# EAGLE schematic untitled (EAGLE 8.4.0)
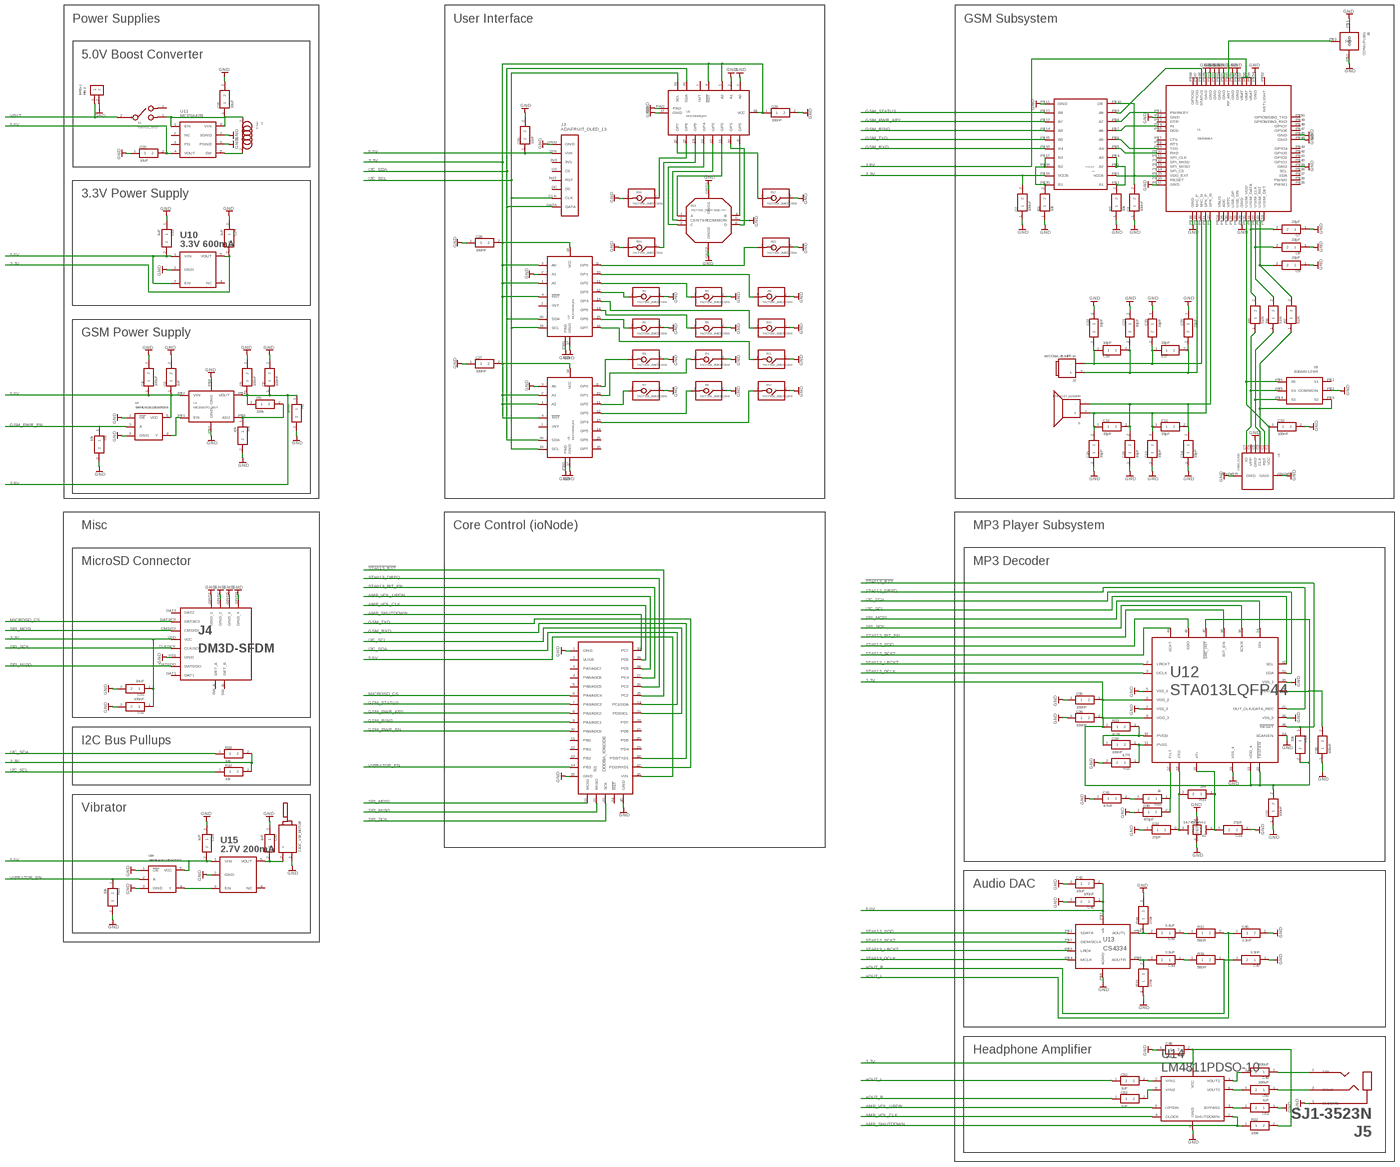
[diagram p0: schematic, sheet 1, overview]
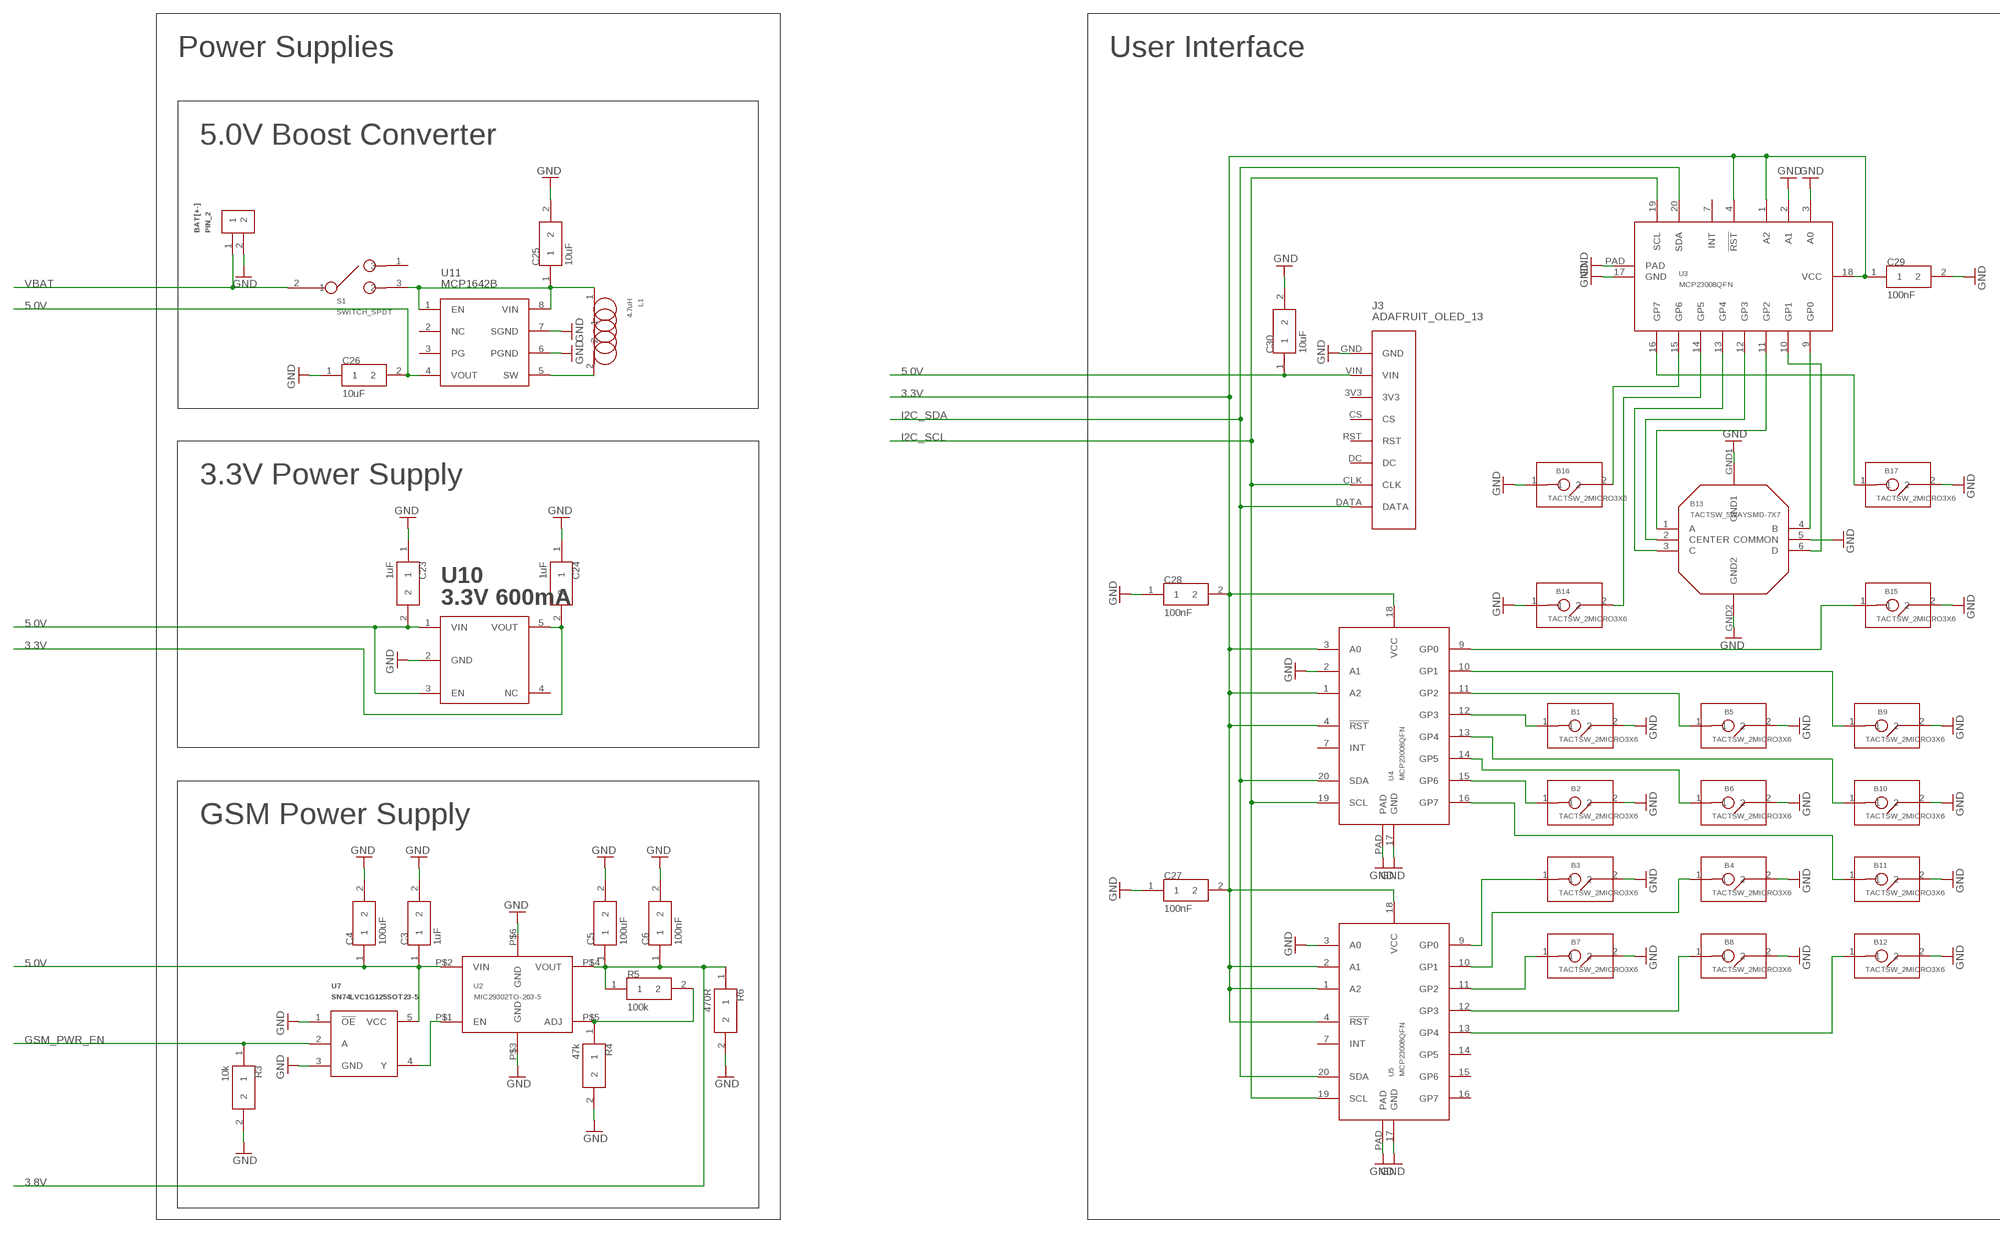
[diagram p1: schematic, sheet 1, part 1 of 4]
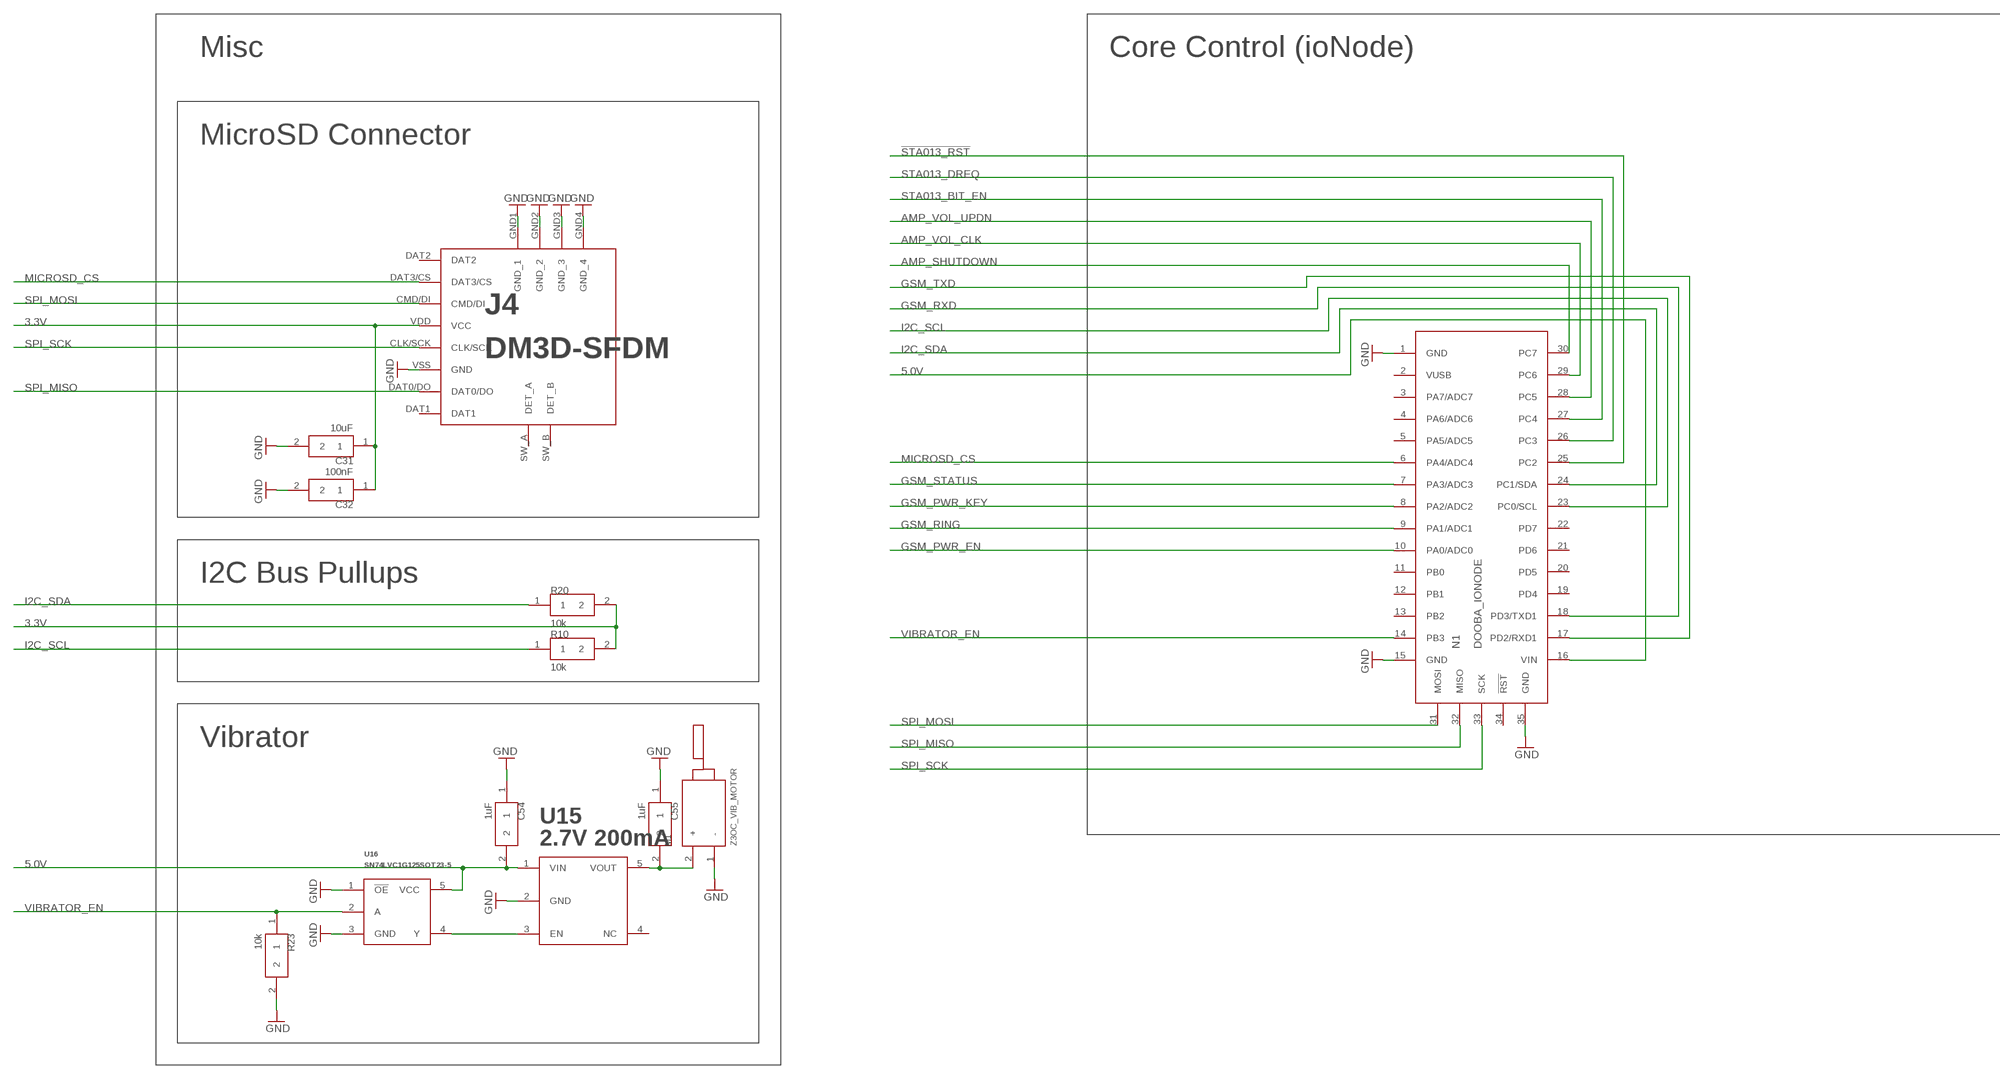
[diagram p2: schematic, sheet 1, part 2 of 4]
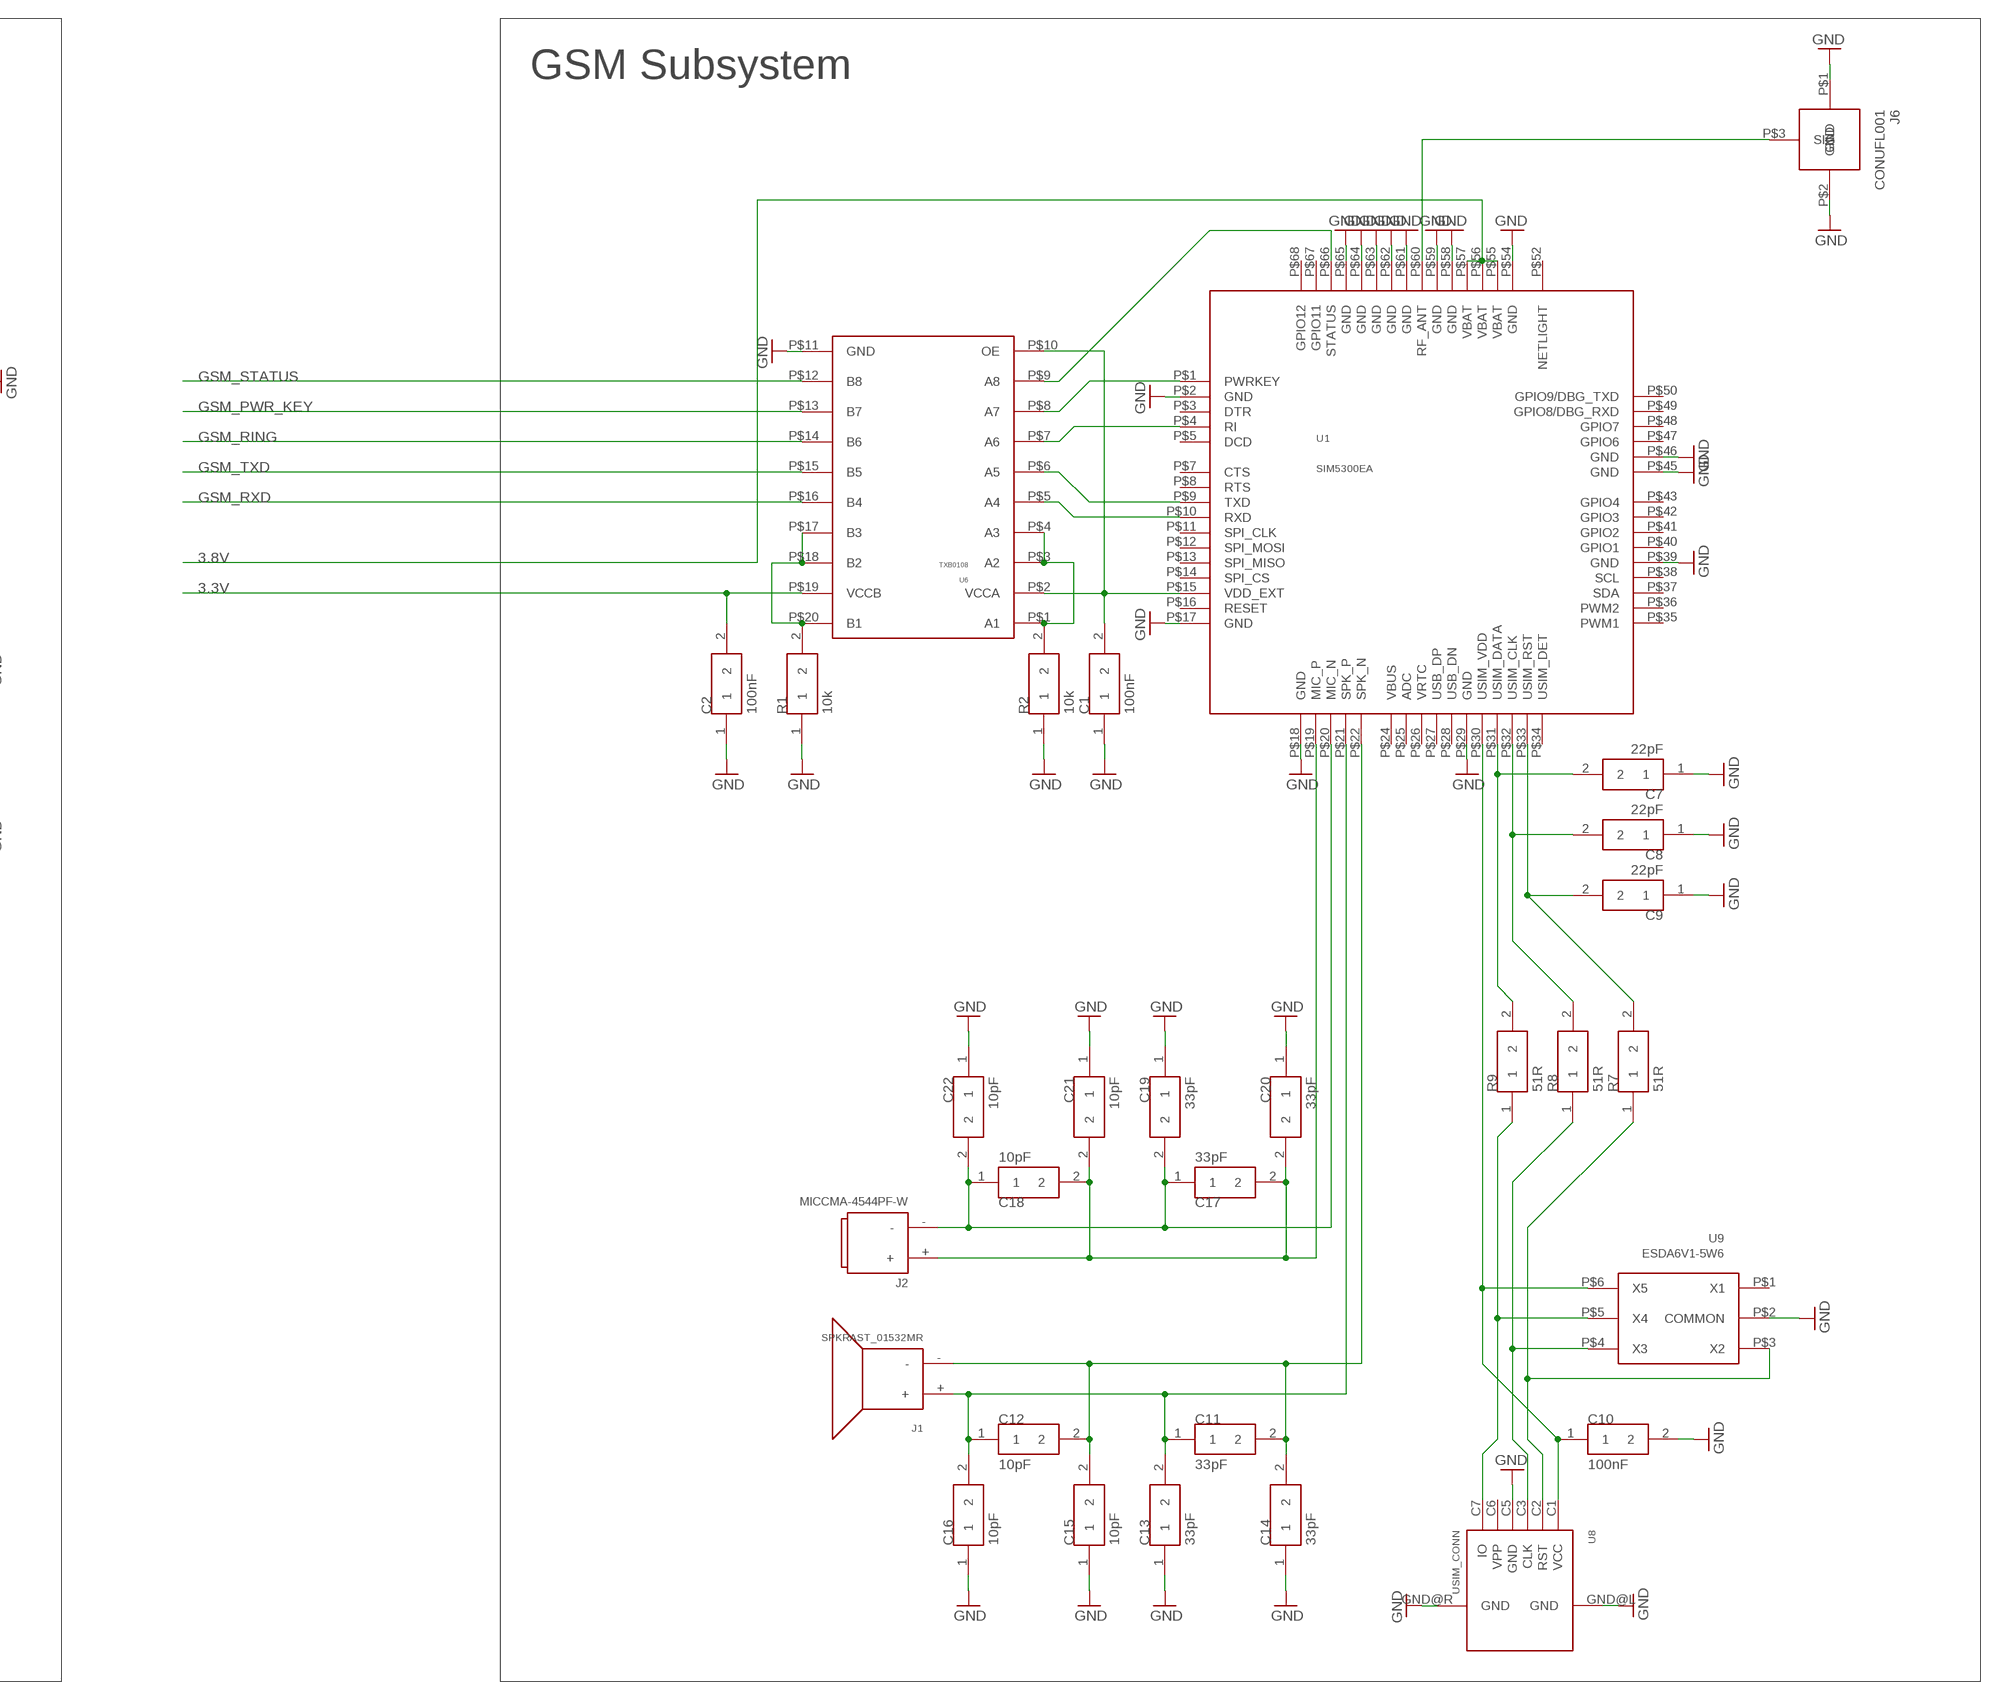
[diagram p3: schematic, sheet 1, part 3 of 4]
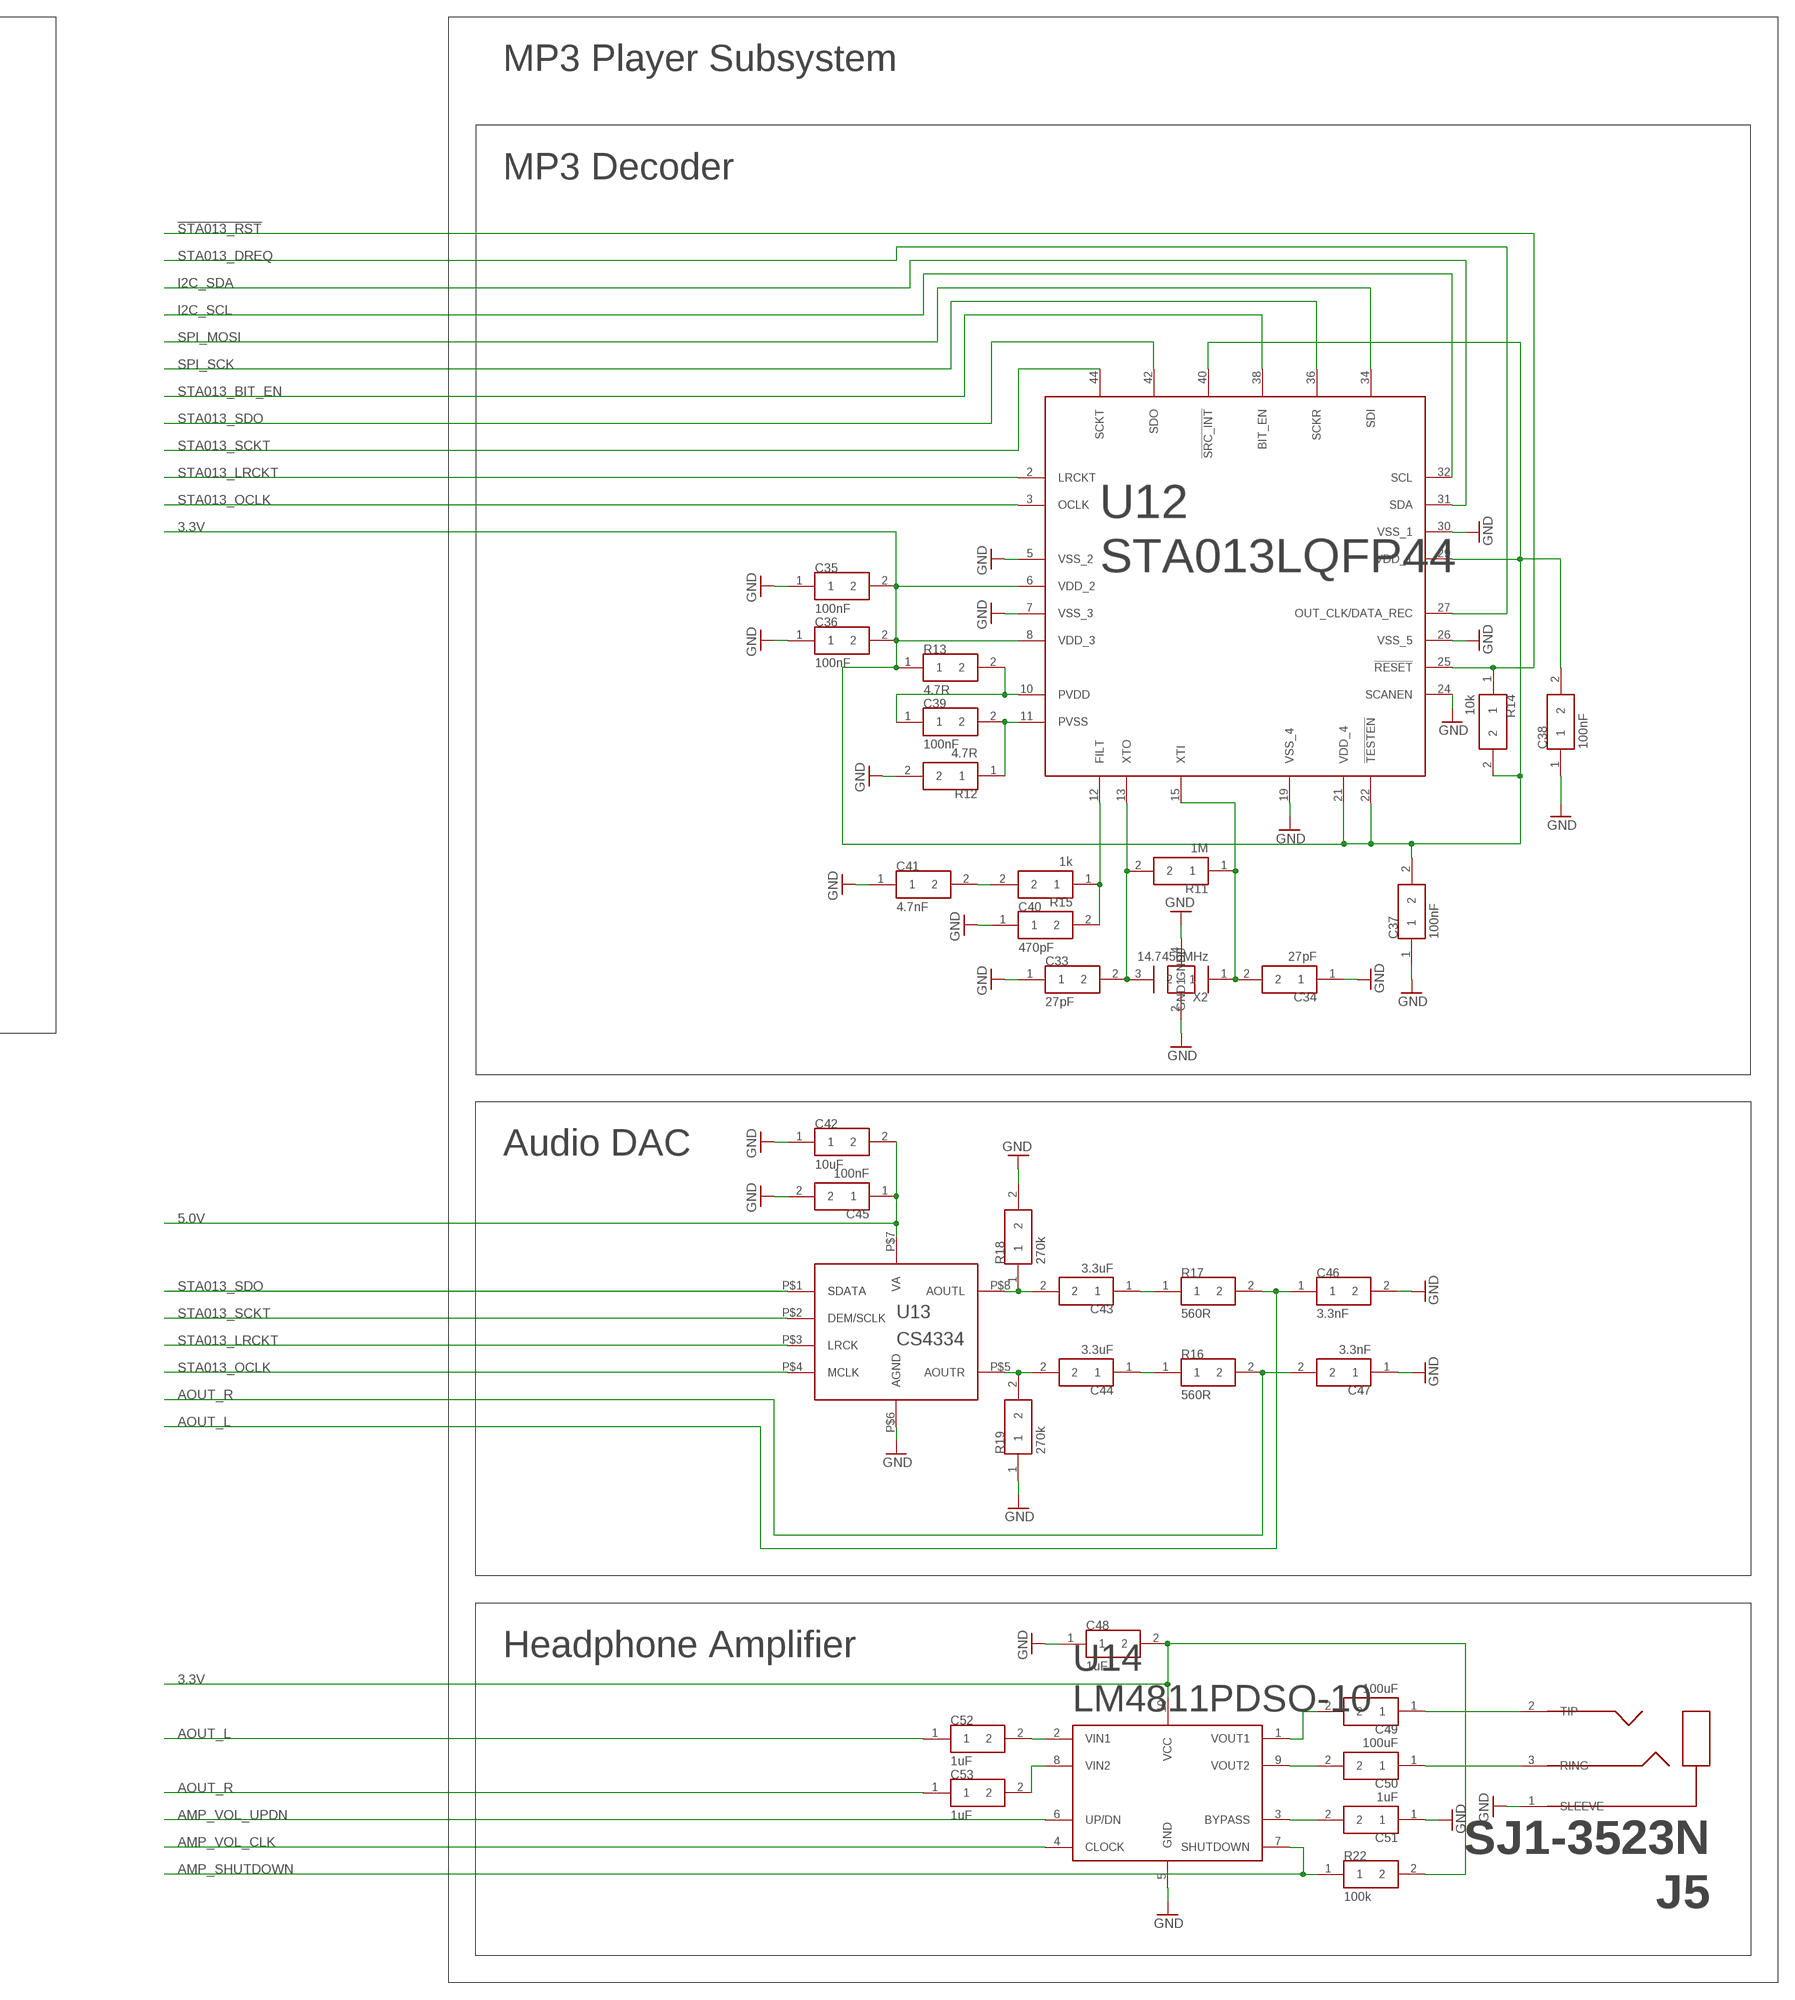
[diagram p4: schematic, sheet 1, part 4 of 4]

## Parts
B1  TACTSW_2MICRO3X6  [TACTSW_MICRO3X6]
B2  TACTSW_2MICRO3X6  [TACTSW_MICRO3X6]
B3  TACTSW_2MICRO3X6  [TACTSW_MICRO3X6]
B4  TACTSW_2MICRO3X6  [TACTSW_MICRO3X6]
B5  TACTSW_2MICRO3X6  [TACTSW_MICRO3X6]
B6  TACTSW_2MICRO3X6  [TACTSW_MICRO3X6]
B7  TACTSW_2MICRO3X6  [TACTSW_MICRO3X6]
B8  TACTSW_2MICRO3X6  [TACTSW_MICRO3X6]
B9  TACTSW_2MICRO3X6  [TACTSW_MICRO3X6]
B10  TACTSW_2MICRO3X6  [TACTSW_MICRO3X6]
B11  TACTSW_2MICRO3X6  [TACTSW_MICRO3X6]
B12  TACTSW_2MICRO3X6  [TACTSW_MICRO3X6]
B13  TACTSW_5WAYSMD-7X7  [TACTSW-5WAY-7X7]
B14  TACTSW_2MICRO3X6  [TACTSW_MICRO3X6]
B15  TACTSW_2MICRO3X6  [TACTSW_MICRO3X6]
B16  TACTSW_2MICRO3X6  [TACTSW_MICRO3X6]
B17  TACTSW_2MICRO3X6  [TACTSW_MICRO3X6]
BAT[+-]  PIN_2  [PIN_2]
C1  100nF  CAP0805  [0805]
C2  100nF  CAP0805  [0805]
C3  1uF  CAP0805  [0805]
C4  100uF  CAP1210  [1210]
C5  100uF  CAP1210  [1210]
C6  100nF  CAP0805  [0805]
C7  22pF  CAP0805  [0805]
C8  22pF  CAP0805  [0805]
C9  22pF  CAP0805  [0805]
C10  100nF  CAP0805  [0805]
C11  33pF  CAP0805  [0805]
C12  10pF  CAP0805  [0805]
C13  33pF  CAP0805  [0805]
C14  33pF  CAP0805  [0805]
C15  10pF  CAP0805  [0805]
C16  10pF  CAP0805  [0805]
C17  33pF  CAP0805  [0805]
C18  10pF  CAP0805  [0805]
C19  33pF  CAP0805  [0805]
C20  33pF  CAP0805  [0805]
C21  10pF  CAP0805  [0805]
C22  10pF  CAP0805  [0805]
C23  1uF  CAP0805  [0805]
C24  1uF  CAP0805  [0805]
C25  10uF  CAP0805  [0805]
C26  10uF  CAP0805  [0805]
C27  100nF  CAP0805  [0805]
C28  100nF  CAP0805  [0805]
C29  100nF  CAP0805  [0805]
C30  10uF  CAP0805  [0805]
C31  10uF  CAP0805  [0805]
C32  100nF  CAP0805  [0805]
C33  27pF  CAP0805  [0805]
C34  27pF  CAP0805  [0805]
C35  100nF  CAP0805  [0805]
C36  100nF  CAP0805  [0805]
C37  100nF  CAP0805  [0805]
C38  100nF  CAP0805  [0805]
C39  100nF  CAP0805  [0805]
C40  470pF  CAP0805  [0805]
C41  4.7nF  CAP0805  [0805]
C42  10uF  CAP0805  [0805]
C43  3.3uF  CAP0805  [0805]
C44  3.3uF  CAP0805  [0805]
C45  100nF  CAP0805  [0805]
C46  3.3nF  CAP0805  [0805]
C47  3.3nF  CAP0805  [0805]
C48  1uF  CAP0805  [0805]
C49  100uF  CAP1210  [1210]
C50  100uF  CAP1210  [1210]
C51  1uF  CAP0805  [0805]
C52  1uF  CAP0805  [0805]
C53  1uF  CAP0805  [0805]
C54  1uF  CAP0805  [0805]
C55  1uF  CAP0805  [0805]
J1  SPKRAST_01532MR  [SPKR_AST_01532MR]
J2  MICCMA-4544PF-W  [MIC_CMA-4544PF-W]
J3  ADAFRUIT_OLED_13  [ADAFRUIT_OLED_13]
J4  DM3D-SFDM  [DM3D-SF]
J5  SJ1-3523N  [SJ1-352XN]
J6  CONUFL001  [CONUFL001]
L1  4.7uH  IND2520  [2520]
M1  Z3OC_VIB_MOTOR  [Z3OC_VIB_MOTOR]
N1  DOOBA_IONODE  [DOOBA_IONODE]
R1  10k  RES0805  [0805]
R2  10k  RES0805  [0805]
R3  10k  RES0805  [0805]
R4  47k  RES0805  [0805]
R5  100k  RES0805  [0805]
R6  470R  RES0805  [0805]
R7  51R  RES0805  [0805]
R8  51R  RES0805  [0805]
R9  51R  RES0805  [0805]
R10  10k  RES0805  [0805]
R11  1M  RES0805  [0805]
R12  4.7R  RES0805  [0805]
R13  4.7R  RES0805  [0805]
R14  10k  RES0805  [0805]
R15  1k  RES0805  [0805]
R16  560R  RES0805  [0805]
R17  560R  RES0805  [0805]
R18  270k  RES0805  [0805]
R19  270k  RES0805  [0805]
R20  10k  RES0805  [0805]
R22  100k  RES0805  [0805]
R23  10k  RES0805  [0805]
S1  SWITCH_SPDT  [JS102011]
U1  SIM5300EA  [SIM5300]
U2  MIC29302TO-263-5  [TO-263]
U3  MCP23008QFN  [20-VQFN]
U4  MCP23008QFN  [20-VQFN]
U5  MCP23008QFN  [20-VQFN]
U6  TXB0108  [TSSOP-20]
U7  SN74LVC1G125SOT23-5  [SOT23-5]
U8  USIM_CONN  [WE_USIM_HINGE]
U9  ESDA6V1-5W6  [SOT-323-6L]
U10  3.3V 600mA  LP3985SOT23-5  [SOT23-5]
U11  MCP1642B  [MSOP8]
U12  STA013LQFP44  [QFP44]
U13  CS4334  [SO8]
U14  LM4811PDSO-10  [PDSO-10]
U15  2.7V 200mA  LP3985SOT23-5  [SOT23-5]
U16  SN74LVC1G125SOT23-5  [SOT23-5]
X2  14.7456MHz  XTAL_GNDSMD_3225  [XTAL_3225]

## Nets
2.7V: C55.2 M1.2(+) U15.5(VOUT)
3.3V: C2.2 C24.2 C27.2 C28.2 C29.1 C31.1 C32.1 C35.2 C36.2 C37.2 C38.2 C48.2 J4.VDD(VCC) R10.2 R13.1 R14.2 R20.2 R22.2 U3.1(A2) U3.4(!RST) U3.18(VCC) U4.1(A2) U4.3(A0) U4.4(!RST) U4.18(VCC) U5.1(A2) U5.2(A1) U5.4(!RST) U5.18(VCC) U6.P$19(VCCB) U10.5(VOUT) U12.6(VDD_2) U12.8(VDD_3) U12.21(VDD_4) U12.22(!TESTEN) U12.29(VDD_1) U12.40(!SRC_INT) U14.10(VCC)
3.8V: C5.1 C6.1 R5.1 R6.1 U1.P$55(VBAT) U1.P$56(VBAT) U1.P$57(VBAT) U2.P$4(VOUT)
5.0V: C3.1 C4.1 C23.2 C26.2 C30.1 C42.2 C45.1 C54.2 J3.VIN N1.16(VIN) U2.P$2(VIN) U7.5(VCC) U10.1(VIN) U10.3(EN) U11.4(VOUT) U13.P$7(VA) U15.1(VIN) U16.5(VCC)
!STA013_RST: N1.25(PC2) R14.1 U12.25(!RESET)
AMP_SHUTDOWN: N1.30(PC7) R22.1 U14.7(SHUTDOWN)
AMP_VOL_CLK: N1.29(PC6) U14.4(CLOCK)
AMP_VOL_UPDN: N1.28(PC5) U14.6(UP/DN)
AOUT_L: C46.1 C52.1 R17.2
AOUT_R: C47.2 C53.1 R16.2
GND: B1.2 B2.2 B3.2 B4.2 B5.2 B6.2 B7.2 B8.2 B9.2 B10.2 B11.2 B12.2 B13.5(COMMON) B13.GND1 B13.GND2 B14.1 B15.2 B16.1 B17.2 BAT[+-].2 C1.1 C2.1 C3.2 C4.2 C5.2 C6.2 C7.1 C8.1 C9.1 C10.2 C13.1 C14.1 C15.1 C16.1 C19.1 C20.1 C21.1 C22.1 C23.1 C24.1 C25.2 C26.1 C27.1 C28.1 C29.2 C30.2 C31.2 C32.2 C33.1 C34.1 C35.1 C36.1 C37.1 C38.1 C40.1 C41.1 C42.1 C45.2 C46.2 C47.1 C48.1 C51.1 C54.1 C55.1 J3.GND J4.GND1(GND_1) J4.GND2(GND_2) J4.GND3(GND_3) J4.GND4(GND_4) J4.VSS(GND) J5.1(SLEEVE) J6.P$1(GND) J6.P$2(GND) M1.1(-) N1.1(GND) N1.15(GND) N1.35(GND) R1.1 R2.1 R3.2 R4.2 R6.2 R12.2 R18.2 R19.1 R23.2 U1.P$2(GND) U1.P$17(GND) U1.P$18(GND) U1.P$29(GND) U1.P$39(GND) U1.P$45(GND) U1.P$46(GND) U1.P$54(GND) U1.P$58(GND) U1.P$59(GND) U1.P$61(GND) U1.P$62(GND) U1.P$63(GND) U1.P$64(GND) U1.P$65(GND) U2.P$3(GND) U2.P$6(GND) U3.2(A1) U3.3(A0) U3.17(GND) U3.PAD U4.2(A1) U4.17(GND) U4.PAD U5.3(A0) U5.17(GND) U5.PAD U6.P$11(GND) U7.1(!OE) U7.3(GND) U8.C5(GND) U8.GND@L(GND) U8.GND@R(GND) U9.P$2(COMMON) U10.2(GND) U11.6(PGND) U11.7(SGND) U12.5(VSS_2) U12.7(VSS_3) U12.19(VSS_4) U12.24(SCANEN) U12.26(VSS_5) U12.30(VSS_1) U13.P$6(AGND) U14.5(GND) U15.2(GND) U16.1(!OE) U16.3(GND) X2.2(GND0) X2.4(GND1)
GSM_PWR_EN: N1.10(PA0/ADC0) R3.1 U7.2(A)
GSM_PWR_KEY: N1.8(PA2/ADC2) U6.P$13(B7)
GSM_RING: N1.9(PA1/ADC1) U6.P$14(B6)
GSM_RXD: N1.18(PD3/TXD1) U6.P$16(B4)
GSM_STATUS: N1.7(PA3/ADC3) U6.P$12(B8)
GSM_TXD: N1.17(PD2/RXD1) U6.P$15(B5)
I2C_SCL: J3.CLK N1.23(PC0/SCL) R10.1 U3.19(SCL) U4.19(SCL) U5.19(SCL) U12.32(SCL)
I2C_SDA: J3.DATA N1.24(PC1/SDA) R20.1 U3.20(SDA) U4.20(SDA) U5.20(SDA) U12.31(SDA)
MICROSD_CS: J4.DAT3/CS N1.6(PA4/ADC4)
N$1: B13.4(B) U3.9(GP0)
N$2: B13.1(A) U3.11(GP2)
N$3: B13.2(CENTER) U3.12(GP3)
N$4: B13.3(C) U3.13(GP4)
N$5: B13.6(D) U3.10(GP1)
N$6: B14.2 U3.14(GP5)
N$7: B16.2 U3.15(GP6)
N$8: B17.1 U3.16(GP7)
N$9: B15.1 U4.9(GP0)
N$10: B9.1 U4.10(GP1)
N$11: B5.1 U4.11(GP2)
N$12: B1.1 U4.12(GP3)
N$13: B10.1 U4.13(GP4)
N$14: B6.1 U4.14(GP5)
N$15: B2.1 U4.15(GP6)
N$16: B11.1 U4.16(GP7)
N$17: B3.1 U5.9(GP0)
N$18: B4.1 U5.10(GP1)
N$19: B7.1 U5.11(GP2)
N$20: B8.1 U5.12(GP3)
N$21: B12.1 U5.13(GP4)
N$22: C1.2 U1.P$15(VDD_EXT) U6.P$2(VCCA) U6.P$10(OE)
N$23: U1.P$66(STATUS) U6.P$9(A8)
N$24: U1.P$1(PWRKEY) U6.P$8(A7)
N$25: U1.P$4(RI) U6.P$7(A6)
N$26: U1.P$9(TXD) U6.P$6(A5)
N$27: U1.P$10(RXD) U6.P$5(A4)
N$28: U2.P$1(EN) U7.4(Y)
N$29: R4.1 R5.2 U2.P$5(ADJ)
N$30: R1.2 U6.P$17(B3) U6.P$18(B2) U6.P$20(B1)
N$31: C10.1 U1.P$30(USIM_VDD) U8.C1(VCC) U9.P$6(X5)
N$32: R2.2 U6.P$1(A1) U6.P$3(A2) U6.P$4(A3)
N$33: R9.1 U8.C7(IO) U9.P$5(X4)
N$34: R8.1 U8.C3(CLK) U9.P$4(X3)
N$35: C34.2 R11.1 U12.15(XTI) X2.1
N$36: R7.1 U8.C2(RST) U9.P$3(X2)
N$37: C9.2 R7.2 U1.P$33(USIM_RST)
N$38: C8.2 R8.2 U1.P$32(USIM_CLK)
N$39: C7.2 R9.2 U1.P$31(USIM_DATA)
N$40: C33.2 R11.2 U12.13(XTO) X2.3
N$41: L1.2 U11.5(SW)
N$42: C39.1 R13.2 U12.10(PVDD)
N$43: C11.2 C12.2 C14.2 C15.2 J1.- U1.P$22(SPK_N)
N$44: C11.1 C12.1 C13.2 C16.2 J1.+ U1.P$21(SPK_P)
N$45: C39.2 R12.1 U12.11(PVSS)
N$46: C41.2 R15.2
N$47: C17.2 C18.2 C20.2 C21.2 J2.+ U1.P$19(MIC_P)
N$48: C17.1 C18.1 C19.2 C22.2 J2.- U1.P$20(MIC_N)
N$49: C40.2 R15.1 U12.12(FILT)
N$50: C43.2 R18.1 U13.P$8(AOUTL)
N$51: C44.2 R19.2 U13.P$5(AOUTR)
N$52: C44.1 R16.1
N$53: C43.1 R17.1
N$54: C49.2 U14.1(VOUT1)
N$55: C50.2 U14.9(VOUT2)
N$56: C51.2 U14.3(BYPASS)
N$57: C50.1 J5.3(RING)
N$58: C52.2 U14.2(VIN1)
N$59: C53.2 U14.8(VIN2)
N$60: C49.1 J5.2(TIP)
N$61: J6.P$3(SIG) U1.P$60(RF_ANT)
N$62: U15.3(EN) U16.4(Y)
SPI_MISO: J4.DAT0/DO N1.32(MISO)
SPI_MOSI: J4.CMD/DI N1.31(MOSI) U12.34(SDI)
SPI_SCK: J4.CLK/SCK N1.33(SCK) U12.36(SCKR)
STA013_BIT_EN: N1.27(PC4) U12.38(BIT_EN)
STA013_DREQ: N1.26(PC3) U12.27(OUT_CLK/DATA_REC)
STA013_LRCKT: U12.2(LRCKT) U13.P$3(LRCK)
STA013_OCLK: U12.3(OCLK) U13.P$4(MCLK)
STA013_SCKT: U12.44(SCKT) U13.P$2(DEM/SCLK)
STA013_SDO: U12.42(SDO) U13.P$1(SDATA)
VBAT: BAT[+-].1 S1.2
VIBRATOR_EN: N1.14(PB3) R23.1 U16.2(A)
VIN: C25.1 L1.1 S1.3 U11.1(EN) U11.8(VIN)
Unconnected: J3.3V3 J3.CS J3.DC J3.RST J4.DAT1 J4.DAT2 J4.SW_A(DET_A) J4.SW_B(DET_B) N1.2(VUSB) N1.3(PA7/ADC7) N1.4(PA6/ADC6) N1.5(PA5/ADC5) N1.11(PB0) N1.12(PB1) N1.13(PB2) N1.19(PD4) N1.20(PD5) N1.21(PD6) N1.22(PD7) N1.34(!RST) S1.1 U1.P$3(DTR) U1.P$5(DCD) U1.P$7(CTS) U1.P$8(RTS) U1.P$11(SPI_CLK) U1.P$12(SPI_MOSI) U1.P$13(SPI_MISO) U1.P$14(SPI_CS) U1.P$16(RESET) U1.P$24(VBUS) U1.P$25(ADC) U1.P$26(VRTC) U1.P$27(USB_DP) U1.P$28(USB_DN) U1.P$34(USIM_DET) U1.P$35(PWM1) U1.P$36(PWM2) U1.P$37(SDA) U1.P$38(SCL) U1.P$40(GPIO1) U1.P$41(GPIO2) U1.P$42(GPIO3) U1.P$43(GPIO4) U1.P$47(GPIO6) U1.P$48(GPIO7) U1.P$49(GPIO8/DBG_RXD) U1.P$50(GPIO9/DBG_TXD) U1.P$52(NETLIGHT) U1.P$67(GPIO11) U1.P$68(GPIO12) U3.7(INT) U4.7(INT) U5.7(INT) U5.14(GP5) U5.15(GP6) U5.16(GP7) U8.C6(VPP) U9.P$1(X1) U10.4(NC) U11.2(NC) U11.3(PG) U15.4(NC)

## Notes on the sheet
- Power Supplies | User Interface | GSM Subsystem
- 5.0V Boost Converter
- 3.3V Power Supply
- GSM Power Supply
- Misc | Core Control (ioNode) | MP3 Player Subsystem
- MicroSD Connector | MP3 Decoder
- I2C Bus Pullups
- Vibrator
- Audio DAC
- Headphone Amplifier

## Library data of the parts
B1-B12 B14-B17 = dooba:TACTSW_2
B13 = dooba:TACTSW_5WAY
BAT[+-] = dooba:PIN_2
C1-C55 = dooba:CAP
J1 = dooba:SPKR
J2 = dooba:MIC
J3 = dooba:ADAFRUIT_OLED_13
J4 = dooba:DM3D-SF
J5 = dooba:SJ1-3523N
J6 = dooba:CONUFL001
L1 = dooba:IND
M1 = dooba:Z3OC_VIB_MOTOR
N1 = dooba:DOOBA_IONODE
R1-R20 R22 R23 = dooba:RES
S1 = dooba:SWITCH_SPDT
U1 = dooba:SIM5300EA
U2 = dooba:MIC29302
U3-U5 = dooba:MCP23008
U6 = dooba:TXB0108
U7 U16 = dooba:SN74LVC1G125
U8 = dooba:USIM_CONN
U9 = dooba:ESDA6V1-5W6
U10 U15 = dooba:LP3985
U11 = dooba:MCP1642B
U12 = dooba:STA013
U13 = dooba:CS4334
U14 = dooba:LM4811
X2 = dooba:XTAL_GND